# Altium schematic sheet Wireless_Charger-X01.SchDoc
size A4; SheetNumber: 1; SheetTotal: 1
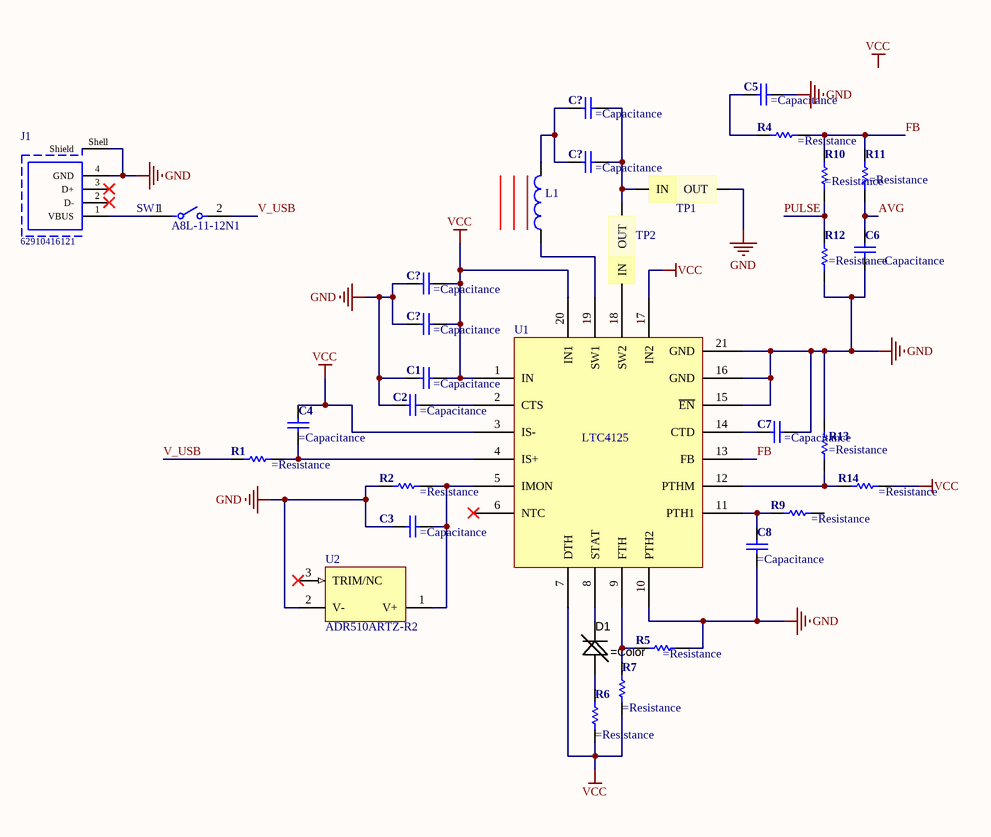
[diagram p0: Wireless_Charger-X01.SchDoc]

## Parts
(Parts that share a designator on the sheet are numbered #1, #2 ... from top to bottom, then left to right.)
C1  (no value)  [C0402]
C2  (no value)  [C0402]
C3  (no value)  [C0402]
C4  (no value)  [C0402]
C5  (no value)  [C0402]
C6  (no value)  [C0402]
C7  (no value)  [C0402]
C8  (no value)  [C0402]
C?#1  (no value)
C?#2  (no value)
C?#3  (no value)
C?#4  (no value)
D1  (no value)  [LED_0402]
J1  62910416121  [62910416121]
L1  WIRELESS CHARGING COIL, TRANSMITTER  [760308101104]  (value not drawn)
R1  (no value)  [R0402]
R2  (no value)  [R0402]
R4  (no value)  [R0402]
R5  (no value)  [R0402]
R6  (no value)  [R0402]
R7  (no value)  [R0402]
R9  (no value)  [R0402]
R10  (no value)  [R0402]
R11  (no value)  [R0402]
R12  (no value)  [R0402]
R13  (no value)  [R0402]
R14  (no value)  [R0402]
SW1  A8L-11-12N1  [FP-A8L-11-12N1-MFG]
TP1  JUMPER  [JUMPER]  (value not drawn)
TP2  JUMPER  [JUMPER]  (value not drawn)
U1  LTC4125  [20-QFN]
U2  ADR510ARTZ-R2  [ADI-RT-3_M]

## Nets
GND: C1.1 C2.1 C3.1 C5.2 C6.2 C7.2 C8.2 C?#3.1 C?#4.1 J1.4(GND) J1.Shell(Shield) R2.1 R5.2 R12.2 R13.1 TP1.2(OUT) U1.10(PTH2) U1.15(~{EN}) U1.16(GND) U1.21(GND) U2.2(V-)
VCC: C1.2 C4.1 C?#3.2 C?#4.2 R6.1 R7.2 R14.2 U1.1(IN) U1.3(IS-) U1.7(DTH) U1.17(IN2) U1.20(IN1)
AVG: C6.1 R11.2
FB: R4.2 R10.1 R11.1 U1.13(FB)
PULSE: R10.2 R12.1
V_USB: R1.1 SW1.2
NetC2_2: C2.2 U1.2(CTS)
NetC3_2: C3.2 R2.2 U1.5(IMON) U2.1(V+)
NetC4_2: C4.2 R1.2 U1.4(IS+)
NetC5_1: C5.1 R4.1
NetC7_1: C7.1 U1.14(CTD)
NetC8_1: C8.1 R9.1 U1.11(PTH1)
NetC?#1_1: C?#1.1 C?#2.1 L1.2
NetC?#1_2: C?#1.2 C?#2.2 TP1.1(IN) TP2.2(OUT)
NetD1_A: D1.A R6.2
NetD1_K: D1.K U1.8(STAT)
NetJ1_1: J1.1(VBUS) SW1.1
NetL1_1: L1.1 U1.19(SW1)
NetR5_1: R5.1 R7.1 U1.9(FTH)
NetR13_2: R13.2 R14.1 U1.12(PTHM)
NetTP2_1: TP2.1(IN) U1.18(SW2)

Not connected (* = marked no-connect by the designer): J1 2(D-)* 3(D+)*; R9 2; U1 6(NTC)*; U2 3(TRIM/NC)*

## Notes on the sheet
- Labels drawn without touching a wire or pin: VCC

## Library data of the parts
C1-C8 = C-0402(1005): ___ OHM ___ mW 0402(1005) SMD; ComponentLink1URL: https://datasheet.ciiva.com/169/product-169683.pdf; ComponentLink1Description: https://datasheet.ciiva.com/169/product-169683.pdf
C?#1-C?#4 = C-1210(3225): ___ OHM ___ mW 1210(3225) SMD; ComponentLink1URL: https://datasheet.ciiva.com/169/product-169683.pdf; ComponentLink1Description: https://datasheet.ciiva.com/169/product-169683.pdf
D1 = LED_0402(1005): LED, 0402(1005) SMD
J1 = CMP-1502-03244-1: USB 2.0 Type B Receptacle WR-COM, Horizontal, SMT, with Pads and Pegs; Manufacturer: Wurth Electronics; Number of Contacts: 4; USB Standard: USB 2.0; Number of Ports: 1; Current Rating: 1.5A; Mating Cycles: 1500; Shielding: Shielded; Supplier 1: Digi-Key; Supplier Part Number 1: 732-3152-1-ND; Manufacturer Part Number: 62910416121; RoHS: Yes; Category: Connectors; Stock 1: 80; Pricing 1: 1=3.83000, 10=3.76300, 50=3.49400, 100=3.22600 (USD); Mount: Surface Mount; Contact Plating: Gold; Contact Material: Copper Alloy; Insulation Color: Black; Min Operating Temperature: -40°C; Max Operating Temperature: 105°C; Package Quantity: 150; Packaging: Tape and Reel; Gender: Receptacle; Connector Type: USB; Termination: Solder; Orientation: Right Angle; Features: Shielded; Length: 16mm; REACH SVHC: Unknown; Lead Free: Lead Free; Flammability Rating: UL94 V-0; ComponentLink1URL: https://datasheet.ciiva.com:443/pdfs/VipMasterIC/IC/MIDC/MIDC-S-A0004022663/MIDC-S-A0003061583-1.pdf?src-supplier=IHS+Markit; ComponentLink1Description: https://datasheet.ciiva.com:443/pdfs/VipMasterIC/IC/MIDC/MIDC-S-A0004022663/MIDC-S-A0003061583-1.pdf?src-supplier=IHS+Markit; ComponentLink2URL: https://datasheet.ciiva.com/851/62910416121-851244.pdf?src-supplier=Digi-Key; ComponentLink2Description: https://datasheet.ciiva.com/851/62910416121-851244.pdf?src-supplier=Digi-Key; ComponentLink3URL: https://datasheet.ciiva.com/851/62910416121-851245.pdf?src-supplier=Digi-Key; ComponentLink3Description: https://datasheet.ciiva.com/851/62910416121-851245.pdf?src-supplier=Digi-Key; ComponentLink4URL: https://datasheet.ciiva.com/851/62910416121-851246.pdf?src-supplier=Digi-Key; ComponentLink4Description: https://datasheet.ciiva.com/851/62910416121-851246.pdf?src-supplier=Digi-Key
L1 = WIRELESS_CHARGING_COIL_TRANSMITTER: General Purpose Inductor, 6.8uH, 10%, 1 Element; Manufacturer: Wurth Electronics; DC Resistance (DCR): 125mR; Inductance-Nom (L): 6.5uH; Inductor Application: RF INDUCTOR; Number of Functions: 1; Quality Factor-Min (at L-nom): 42; Rated Current-Max: 2.5A; Self Resonant Frequency: 20MHz; Shape/Size Description: DISK PACKAGE; Shielding: Unshielded; Surface Mount: No; Test Frequency: 125kHz; Description: General Purpose Inductor, 6.5uH, 10%, 1 Element; Supplier 1: Digi-Key; Supplier Part Number 1: 732-9677-ND; Manufacturer Part Number: 760308101104; RoHS: No; Category: Inductors; Stock 1: 1193; Pricing 1: 1=12.32000, 10=11.40400, 66=10.36697, 122=9.42500, 244=8.56803 (USD); Number of Pins: 2; Min Operating Temperature: -20°C; Max Operating Temperature: 105°C; Tolerance: 10%; Inductor Type: GENERAL PURPOSE INDUCTOR; Terminal Placement: Axial; Termination: FLEXIBLE LEAD; REACH SVHC: Yes; RoHS Compliant: No; ComponentLink1URL: https://datasheet.ciiva.com:443/pdfs/VipMasterIC/IC/MIDC/MIDC-S-A0007802517/MIDC-S-A0007768474-1.pdf?src-supplier=IHS+Markit; ComponentLink1Description: https://datasheet.ciiva.com:443/pdfs/VipMasterIC/IC/MIDC/MIDC-S-A0007802517/MIDC-S-A0007768474-1.pdf?src-supplier=IHS+Markit; ComponentLink2URL: http://www.farnell.com/datasheets/2706710.pdf?src-supplier=Farnell; ComponentLink2Description: http://www.farnell.com/datasheets/2706710.pdf?src-supplier=Farnell; ComponentLink3URL: https://katalog.we-online.de/pbs/datasheet/760308101104.pdf?src-supplier=Digi-Key; ComponentLink3Description: https://katalog.we-online.de/pbs/datasheet/760308101104.pdf?src-supplier=Digi-Key; ComponentLink4URL: http://www.farnell.com/datasheets/2706710.pdf?src-supplier=Newark; ComponentLink4Description: http://www.farnell.com/datasheets/2706710.pdf?src-supplier=Newark
R1 R2 R4-R7 R9-R14 = R-0402(1005): ___ OHM ___ mW 0402(1005) SMD
SW1 = CMP-08830-000001-1: SWITCH ROCKER SPST 10A 125V; Manufacturer: Omron; Max Voltage Rating (AC): 250V; Mechanical Life: 50000Cycles; Switch Function: On-Off; Electrical Life: 10000Cycles; Description: Rocker Switch, SPST, Latched, Solder Terminal, Rocker Actuator, Through Hole-straight; Switch Action: LATCHED; Contact AC Max Rating R Load: 10A@250VAC; Operating Force-Max: 3.34N; Body Breadth: 12.5inch; Body Height: 16.5mm; Body Length or Diameter: 21mm; Packaging: Bulk; Mount: Panel; Termination: PC Pins; Orientation: Straight; Max Operating Temperature: 55°C; Current Rating: 10A; RoHS Compliant: Yes; Throw Configuration: SPST; Min Operating Temperature: -20°C; Radiation Hardening: No; Voltage Rating (AC): 125V; Supplier 1: Digi-Key; Supplier Part Number 1: Z4684-ND; Manufacturer Part Number: A8L-11-12N1; RoHS: Yes; Category: Rocker Switches; Stock 1: 282; Pricing 1: 1=2.09000, 10=1.87400, 25=1.77240, 50=1.68780, 100=1.61140, 250=1.54352, 500=1.44176, 1000=1.37392 (USD); Switch Type: Rocker; Actuator Type: Rocker; Contact Current(AC)-Max: 10A; Contact Voltage(AC)-Max: 250V; REACH SVHC: No SVHC; ComponentLink1URL: https://datasheet.ciiva.com:443/pdfs/VipMasterIC/IC/OMRN/OMRN-S-A0001309937/OMRN-S-A0001309937-1.pdf?src-supplier=IHS+Markit; ComponentLink1Description: https://datasheet.ciiva.com:443/pdfs/VipMasterIC/IC/OMRN/OMRN-S-A0001309937/OMRN-S-A0001309937-1.pdf?src-supplier=IHS+Markit; ComponentLink2URL: https://datasheet.ciiva.com/16181/en-a8l-16181881.pdf?src-supplier=Onlinecomponents.com; ComponentLink2Description: https://datasheet.ciiva.com/16181/en-a8l-16181881.pdf?src-supplier=Onlinecomponents.com; ComponentLink3URL: https://datasheet.ciiva.com/48484/en-a8l-48484508.pdf?src-supplier=Avnet; ComponentLink3Description: https://datasheet.ciiva.com/48484/en-a8l-48484508.pdf?src-supplier=Avnet; ComponentLink4URL: https://datasheet.ciiva.com/30083/339en-a8l-30083659.pdf?src-supplier=Onlinecomponents.com; ComponentLink4Description: https://datasheet.ciiva.com/30083/339en-a8l-30083659.pdf?src-supplier=Onlinecomponents.com
TP1 TP2 = JUMPER: SHUNT LP W/HANDLE 2 POS 30AU; Manufacturer: TE Connectivity; Manufacturer Part Number: 8815452; Number of Contacts: 2; Contact Current Rating: 3A; Contact Resistance: 15mR; Gender: Female; Pitch: 2.54mm; Approvals: UL,CSA; Supplier 1: Digi-Key; Supplier Part Number 1: A26242-ND; RoHS: Yes; Category: Headers and Wire Housings; Stock 1: 2099; Pricing 1: 1=0.280000, 10=0.262000, 25=0.223600, 50=0.195600, 100=0.181700, 250=0.160760, 500=0.153760, 1000=0.125800, 2500=0.115320 (USD); Contact Plating: Gold; Housing Color: Black; Housing Material: Thermoplastic; Contact Material: Bronze; Color: Black; Min Operating Temperature: -65°C; Max Operating Temperature: 105°C; Number of Rows: 1; Package Quantity: 14000; Packaging: Bag; Orientation: Straight; Number of Positions: 2; Contact Gender: Female; Current Rating: 3A; Termination: Solder; Length: 5.08mm; Height: 10.9mm; Depth: 10.9mm; Width: 2.5mm; Radiation Hardening: No; Flammability Rating: UL94 V-0; REACH SVHC: No SVHC; ComponentLink1URL: https://datasheet.ciiva.com/1455/92946-1455888.pdf?src-supplier=Newark; ComponentLink1Description: https://datasheet.ciiva.com/1455/92946-1455888.pdf?src-supplier=Newark; ComponentLink2URL: https://datasheet.ciiva.com/19459/841467-19459897.pdf?src-supplier=Jameco; ComponentLink2Description: https://datasheet.ciiva.com/19459/841467-19459897.pdf?src-supplier=Jameco; ComponentLink3URL: https://datasheet.ciiva.com/15174/getdatasheetpartid-155768-15174939.pdf?src-supplier=Verical; ComponentLink3Description: https://datasheet.ciiva.com/15174/getdatasheetpartid-155768-15174939.pdf?src-supplier=Verical; ComponentLink4URL: https://datasheet.ciiva.com/11754/0900766b80da19e8-11754990.pdf?src-supplier=RSComponents; ComponentLink4Description: https://datasheet.ciiva.com/11754/0900766b80da19e8-11754990.pdf?src-supplier=RSComponents; ComponentLink5URL: https://datasheet.ciiva.com/30154/eng-cs-1307819-section-6-7and8-0808-30154293.pdf?src-supplier=Onlinecomponents.com; ComponentLink5Description: https://datasheet.ciiva.com/30154/eng-cs-1307819-section-6-7and8-0808-30154293.pdf?src-supplier=Onlinecomponents.com; ComponentLink6URL: https://datasheet.ciiva.com/767/eng-cd-881545-k3-767850.pdf?src-supplier=Digi-Key; ComponentLink6Description: https://datasheet.ciiva.com/767/eng-cd-881545-k3-767850.pdf?src-supplier=Digi-Key; ComponentLink7URL: https://datasheet.ciiva.com/3120/eng-cs-1307819-section-6-7and8-0808-3120202.pdf?src-supplier=Avnet; ComponentLink7Description: https://datasheet.ciiva.com/3120/eng-cs-1307819-section-6-7and8-0808-3120202.pdf?src-supplier=Avnet
U1 = LTC4125: Power Supply Support Circuit, Adjustable, 1 Channel, CMOS, PQCC20; Manufacturer: Analog Devices / Linear Technology; Manufacturer Part Number: LTC4125EUFD#PBF; Package Body Material: Plastic; Adjustable Threshold: Yes; Number of Channels: 1; Supply Voltage-Max (Vsup): 5.5V; Supply Voltage-Min (Vsup): 3V; Supply Voltage-Nom (Vsup): 5V; Supplier 1: Digi-Key; Supplier Part Number 1: LTC4125EUFD#PBF-ND; RoHS: Yes; Category: Power Management ICs; Stock 1: 155; Pricing 1: 1=9.12000, 10=8.36000, 25=7.60000, 100=6.84000, 250=6.27000, 500=5.70000 (USD); Package Code: HVQCCN; Number of Pins: 20; Package Shape: Rectangular; Terminal Finish: Tin; Min Operating Temperature: -40°C; Max Operating Temperature: 125°C; JESD-609 Code: e3; Analog IC - Other Type: POWER SUPPLY SUPPORT CIRCUIT; Number of Functions: 1; Package Style: CHIP CARRIER, HEAT SINK/SLUG, VERY THIN PROFILEMeter; Surface Mount: Yes; Technology: CMOS; Terminal Form: No Lead; Terminal Position: QUAD; Length: 5mm; Width: 4mm; Height - Seated (Max): 0.8mm; Terminal Pitch: 0.5mm; Temperature Grade: AUTOMOTIVE; REACH SVHC: Yes; RoHS Compliant: Yes; ComponentLink1URL: https://datasheet.ciiva.com:443/pdfs/VipMasterIC/IC/LITC/LITC-S-A0001273422/LITC-S-A0001273422-1.pdf?src-supplier=IHS+Markit; ComponentLink1Description: https://datasheet.ciiva.com:443/pdfs/VipMasterIC/IC/LITC/LITC-S-A0001273422/LITC-S-A0001273422-1.pdf?src-supplier=IHS+Markit; ComponentLink2URL: http://www.farnell.com/datasheets/2015288.pdf?src-supplier=Farnell; ComponentLink2Description: http://www.farnell.com/datasheets/2015288.pdf?src-supplier=Farnell; ComponentLink3URL: http://www.linear.com/docs/47419?src-supplier=Digi-Key; ComponentLink3Description: http://www.linear.com/docs/47419?src-supplier=Digi-Key; ComponentLink4URL: http://www.farnell.com/datasheets/2015288.pdf?src-supplier=Element14; ComponentLink4Description: http://www.farnell.com/datasheets/2015288.pdf?src-supplier=Element14
U2 = CMP-0784-00420-1: Precision Low Noise Shunt Voltage Reference, 1 V Output, Industrial, 3-pin SOT23 (RT-3), Reel; Manufacturer: Analog Devices; Manufacturer Part Number: ADR510ARTZ-REEL7; Vout: 1V; Ref Out TC (ppm/C): 85; Description: Two Terminal Voltage Reference, 1 Output, 1V, Trim/Adjustable, PDSO3; Package Body Material: Plastic; Analog IC - Other Type: TWO TERMINAL VOLTAGE REFERENCE; Number of Functions: 1; Max Output Voltage: 1.0035V; Min Output Voltage: 996.5mV; Package Equivalence Code: TO-236; Temp Coef of Voltage-Max: 85ppm/°C; Time @ Peak Reflow Temperature-Max (s): 40s; Trim/Adjustable Output: Yes; Voltage Tolerance-Max: 0.35%; Qualification Status: Not Qualified; ComponentLink1Description: Manufacturer URL; Packing: Reel; PackageReference: RT-3; ComponentLink4Description: URL Link1; ComponentLink1URL: http://www.analog.com/en/index.html; PackageDescription: 3-Pin Small Outline Transistor Package, Body 2.9 x 1.3 mm, Pitch 0.96 mm; Code_JEDEC: TO-236-AB; Operating Temp Range: -40 to 85 degC; ComponentLink2URL: http://www.analog.com/static/imported-files/data_sheets/ADR510.pdf; DatasheetVersion: Rev. B; ComponentLink2Description: Datasheet; Mounting Technology: Surface Mount; PackageVersion: 011909-C, 02/2009; ComponentLink3URL: http:/www.analog.com/static/imported-files/packages/PKG_PDF/SOT-23-3 (RT)/RT_3.pdf; ComponentLink4URL: Product URL:http://www.analog.com/en/special-linear-functions/voltage-references/adr510/products/product.html; ComponentLink3Description: Package Specification; PartNumber: ADR510ARTZ-R2; Supplier 1: Digi-Key; Supplier Part Number 1: ADR510ARTZ-REEL7CT-ND; RoHS: Yes; Category: Voltage References; Stock 1: 22509; Pricing 1: 1=1.66000, 10=1.48900, 25=1.40440, 100=1.19660, 250=1.12360, 500=0.98316, 1000=0.81461 (USD); Package Code: TSSOP; Number of Pins: 3; Package Shape: Rectangular; Terminal Finish: Tin; Min Operating Temperature: -40°C; Max Operating Temperature: 85°C; JESD-609 Code: e3; JESD-30 Code: R-PDSO-G3; Moisture Sensitivity Level: 1; Number of Outputs: 1; Nominal Output Voltage: 1V; Package Style: SMALL OUTLINE, THIN PROFILE, SHRINK PITCHMeter; Peak Reflow Temperature (Cel): 260°C; Surface Mount: Yes; Terminal Form: Gull Wing; Terminal Position: DUAL; Length: 2.9mm; Width: 1.3mm; Height - Seated (Max): 1.12mm; Terminal Pitch: 0.95mm; Temperature Grade: INDUSTRIAL; REACH SVHC: Yes; RoHS Compliant: Yes; ComponentLink5URL: https://datasheet.ciiva.com:443/pdfs/VipMasterIC/IC/ANDI/ANDI-S-A0002823128/ANDI-S-A0002823128-1.pdf?src-supplier=IHS+Markit; ComponentLink5Description: https://datasheet.ciiva.com:443/pdfs/VipMasterIC/IC/ANDI/ANDI-S-A0002823128/ANDI-S-A0002823128-1.pdf?src-supplier=IHS+Markit; ComponentLink6URL: https://datasheet.ciiva.com/1172/81404-1172803.pdf?src-supplier=Element14; ComponentLink6Description: https://datasheet.ciiva.com/1172/81404-1172803.pdf?src-supplier=Element14; ComponentLink7URL: https://datasheet.ciiva.com/15373/adr510-279234-15373251.pdf?src-supplier=Mouser; ComponentLink7Description: https://datasheet.ciiva.com/15373/adr510-279234-15373251.pdf?src-supplier=Mouser; ComponentLink8URL: https://datasheet.ciiva.com/2005/adr510-2005628.pdf?src-supplier=Digi-Key; ComponentLink8Description: https://datasheet.ciiva.com/2005/adr510-2005628.pdf?src-supplier=Digi-Key; ComponentLink9URL: https://datasheet.ciiva.com/2005/adr510-2005629.pdf?src-supplier=Digi-Key; ComponentLink9Description: https://datasheet.ciiva.com/2005/adr510-2005629.pdf?src-supplier=Digi-Key; ComponentLink10URL: https://datasheet.ciiva.com/2005/adr510-2005630.pdf?src-supplier=Digi-Key; ComponentLink10Description: https://datasheet.ciiva.com/2005/adr510-2005630.pdf?src-supplier=Digi-Key; ComponentLink11URL: https://datasheet.ciiva.com/17216/adr510-17216923.pdf?src-supplier=Avnet+Europe; ComponentLink11Description: https://datasheet.ciiva.com/17216/adr510-17216923.pdf?src-supplier=Avnet+Europe; ComponentLink12URL: https://datasheet.ciiva.com/28474/81404-28474005.pdf?src-supplier=Element14; ComponentLink12Description: https://datasheet.ciiva.com/28474/81404-28474005.pdf?src-supplier=Element14; ComponentLink13URL: https://datasheet.ciiva.com/3235/adr510-3235291.pdf?src-supplier=Avnet; ComponentLink13Description: https://datasheet.ciiva.com/3235/adr510-3235291.pdf?src-supplier=Avnet; ComponentLink14URL: https://datasheet.ciiva.com/3235/adr510-3235758.pdf?src-supplier=Avnet; ComponentLink14Description: https://datasheet.ciiva.com/3235/adr510-3235758.pdf?src-supplier=Avnet